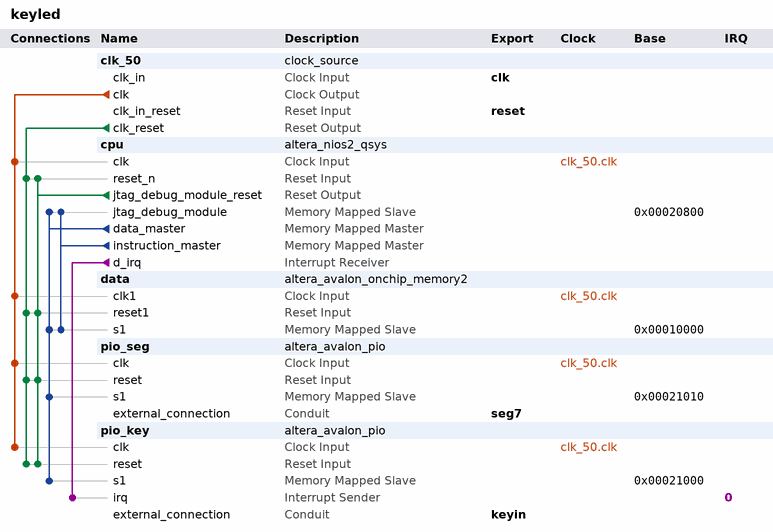
[diagram p0: system contents]
# Platform Designer (Qsys) system keyled, Cyclone IV E EP4CE115F29C7
# Parameters at their usual value, and those the tool derives, are not listed.
package require -exact qsys 13.0.1
create_system keyled
set_project_property DEVICE_FAMILY {Cyclone IV E}
set_project_property DEVICE EP4CE115F29C7

add_instance clk_50 clock_source 13.0
set_instance_parameter_value clk_50 clockFrequency 50000000

add_instance cpu altera_nios2_qsys 13.0
set_instance_parameter_value cpu resetSlave data.s1
set_instance_parameter_value cpu mmu_TLBMissExcSlave None
set_instance_parameter_value cpu exceptionSlave data.s1
set_instance_parameter_value cpu breakSlave cpu.jtag_debug_module
set_instance_parameter_value cpu impl Tiny
set_instance_parameter_value cpu icache_size 4096

add_instance data altera_avalon_onchip_memory2 13.0.1
set_instance_parameter_value data dataWidth 32
set_instance_parameter_value data dualPort false
set_instance_parameter_value data initMemContent true
set_instance_parameter_value data initializationFileName onchip_mem.hex
set_instance_parameter_value data memorySize 40960

add_instance pio_seg altera_avalon_pio 13.0.1
set_instance_parameter_value pio_seg direction Output
set_instance_parameter_value pio_seg width 7

add_instance pio_key altera_avalon_pio 13.0.1
set_instance_parameter_value pio_key captureEdge true
set_instance_parameter_value pio_key direction Input
set_instance_parameter_value pio_key generateIRQ true
set_instance_parameter_value pio_key irqType EDGE
set_instance_parameter_value pio_key width 1

# connections
add_connection clk_50.clk cpu.clk clock
add_connection clk_50.clk data.clk1 clock
add_connection clk_50.clk pio_key.clk clock
add_connection clk_50.clk pio_seg.clk clock
add_connection clk_50.clk_reset cpu.reset_n reset
add_connection clk_50.clk_reset data.reset1 reset
add_connection clk_50.clk_reset pio_key.reset reset
add_connection clk_50.clk_reset pio_seg.reset reset
add_connection cpu.jtag_debug_module_reset cpu.reset_n reset
add_connection cpu.jtag_debug_module_reset data.reset1 reset
add_connection cpu.jtag_debug_module_reset pio_key.reset reset
add_connection cpu.jtag_debug_module_reset pio_seg.reset reset
add_connection cpu.data_master cpu.jtag_debug_module avalon
set_connection_parameter_value cpu.data_master/cpu.jtag_debug_module baseAddress 0x00020800
add_connection cpu.data_master data.s1 avalon
set_connection_parameter_value cpu.data_master/data.s1 baseAddress 0x00010000
add_connection cpu.data_master pio_key.s1 avalon
set_connection_parameter_value cpu.data_master/pio_key.s1 baseAddress 0x00021000
add_connection cpu.data_master pio_seg.s1 avalon
set_connection_parameter_value cpu.data_master/pio_seg.s1 baseAddress 0x00021010
add_connection cpu.instruction_master cpu.jtag_debug_module avalon
set_connection_parameter_value cpu.instruction_master/cpu.jtag_debug_module baseAddress 0x00020800
add_connection cpu.instruction_master data.s1 avalon
set_connection_parameter_value cpu.instruction_master/data.s1 baseAddress 0x00010000
add_connection cpu.d_irq pio_key.irq interrupt
set_connection_parameter_value cpu.d_irq/pio_key.irq irqNumber 0

# exported interfaces
add_interface clk clock sink
set_interface_property clk EXPORT_OF clk_50.clk_in
add_interface reset reset sink
set_interface_property reset EXPORT_OF clk_50.clk_in_reset
add_interface seg7 conduit end
set_interface_property seg7 EXPORT_OF pio_seg.external_connection
add_interface keyin conduit end
set_interface_property keyin EXPORT_OF pio_key.external_connection

set_interconnect_requirement {$system} qsys_mm.clockCrossingAdapter HANDSHAKE
set_interconnect_requirement {$system} qsys_mm.maxAdditionalLatency 1

save_system keyled.qsys
